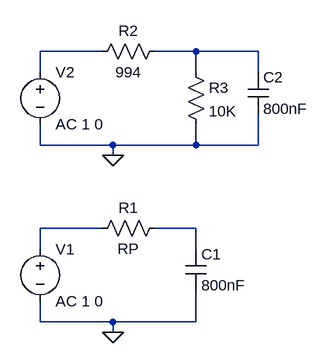
[diagram p0: schematic Th transform.asc]
Th transform.asc, the LTspice schematic file:
Version 4
SHEET 1 880 680
WIRE 112 -176 16 -176
WIRE 256 -176 192 -176
WIRE 352 -176 256 -176
WIRE 16 -144 16 -176
WIRE 256 -144 256 -176
WIRE 352 -144 352 -176
WIRE 16 -32 16 -64
WIRE 128 -32 16 -32
WIRE 256 -32 256 -64
WIRE 256 -32 128 -32
WIRE 352 -32 352 -80
WIRE 352 -32 256 -32
WIRE 128 -16 128 -32
WIRE 112 96 16 96
WIRE 256 96 192 96
WIRE 16 128 16 96
WIRE 256 128 256 96
WIRE 16 240 16 208
WIRE 128 240 16 240
WIRE 256 240 256 192
WIRE 256 240 128 240
WIRE 128 256 128 240
FLAG 128 256 0
FLAG 128 -16 0
SYMBOL voltage 16 112 R0
SYMATTR InstName V1
SYMATTR Value AC 1 0
SYMBOL res 208 80 R90
WINDOW 0 0 56 VBottom 2
WINDOW 3 32 56 VTop 2
SYMATTR InstName R1
SYMATTR Value RP
SYMBOL cap 240 128 R0
SYMATTR InstName C1
SYMATTR Value 800nF
SYMBOL voltage 16 -160 R0
SYMATTR InstName V2
SYMATTR Value AC 1 0
SYMBOL res 208 -192 R90
WINDOW 0 0 56 VBottom 2
WINDOW 3 32 56 VTop 2
SYMATTR InstName R2
SYMATTR Value 994
SYMBOL cap 336 -144 R0
SYMATTR InstName C2
SYMATTR Value 800nF
SYMBOL res 240 -160 R0
SYMATTR InstName R3
SYMATTR Value 10K

The netlist it stands for:
* Th transform.asc
V1 N003 0 AC 1 0
R1 N004 N003 RP
C1 N004 0 800nF
V2 N001 0 AC 1 0
R2 N002 N001 994
C2 N002 0 800nF
R3 N002 0 10K
.backanno
.end